# Altium schematic sheet Block_Diagram.SchDoc
size A2; SheetNumber: 1; SheetTotal: 2
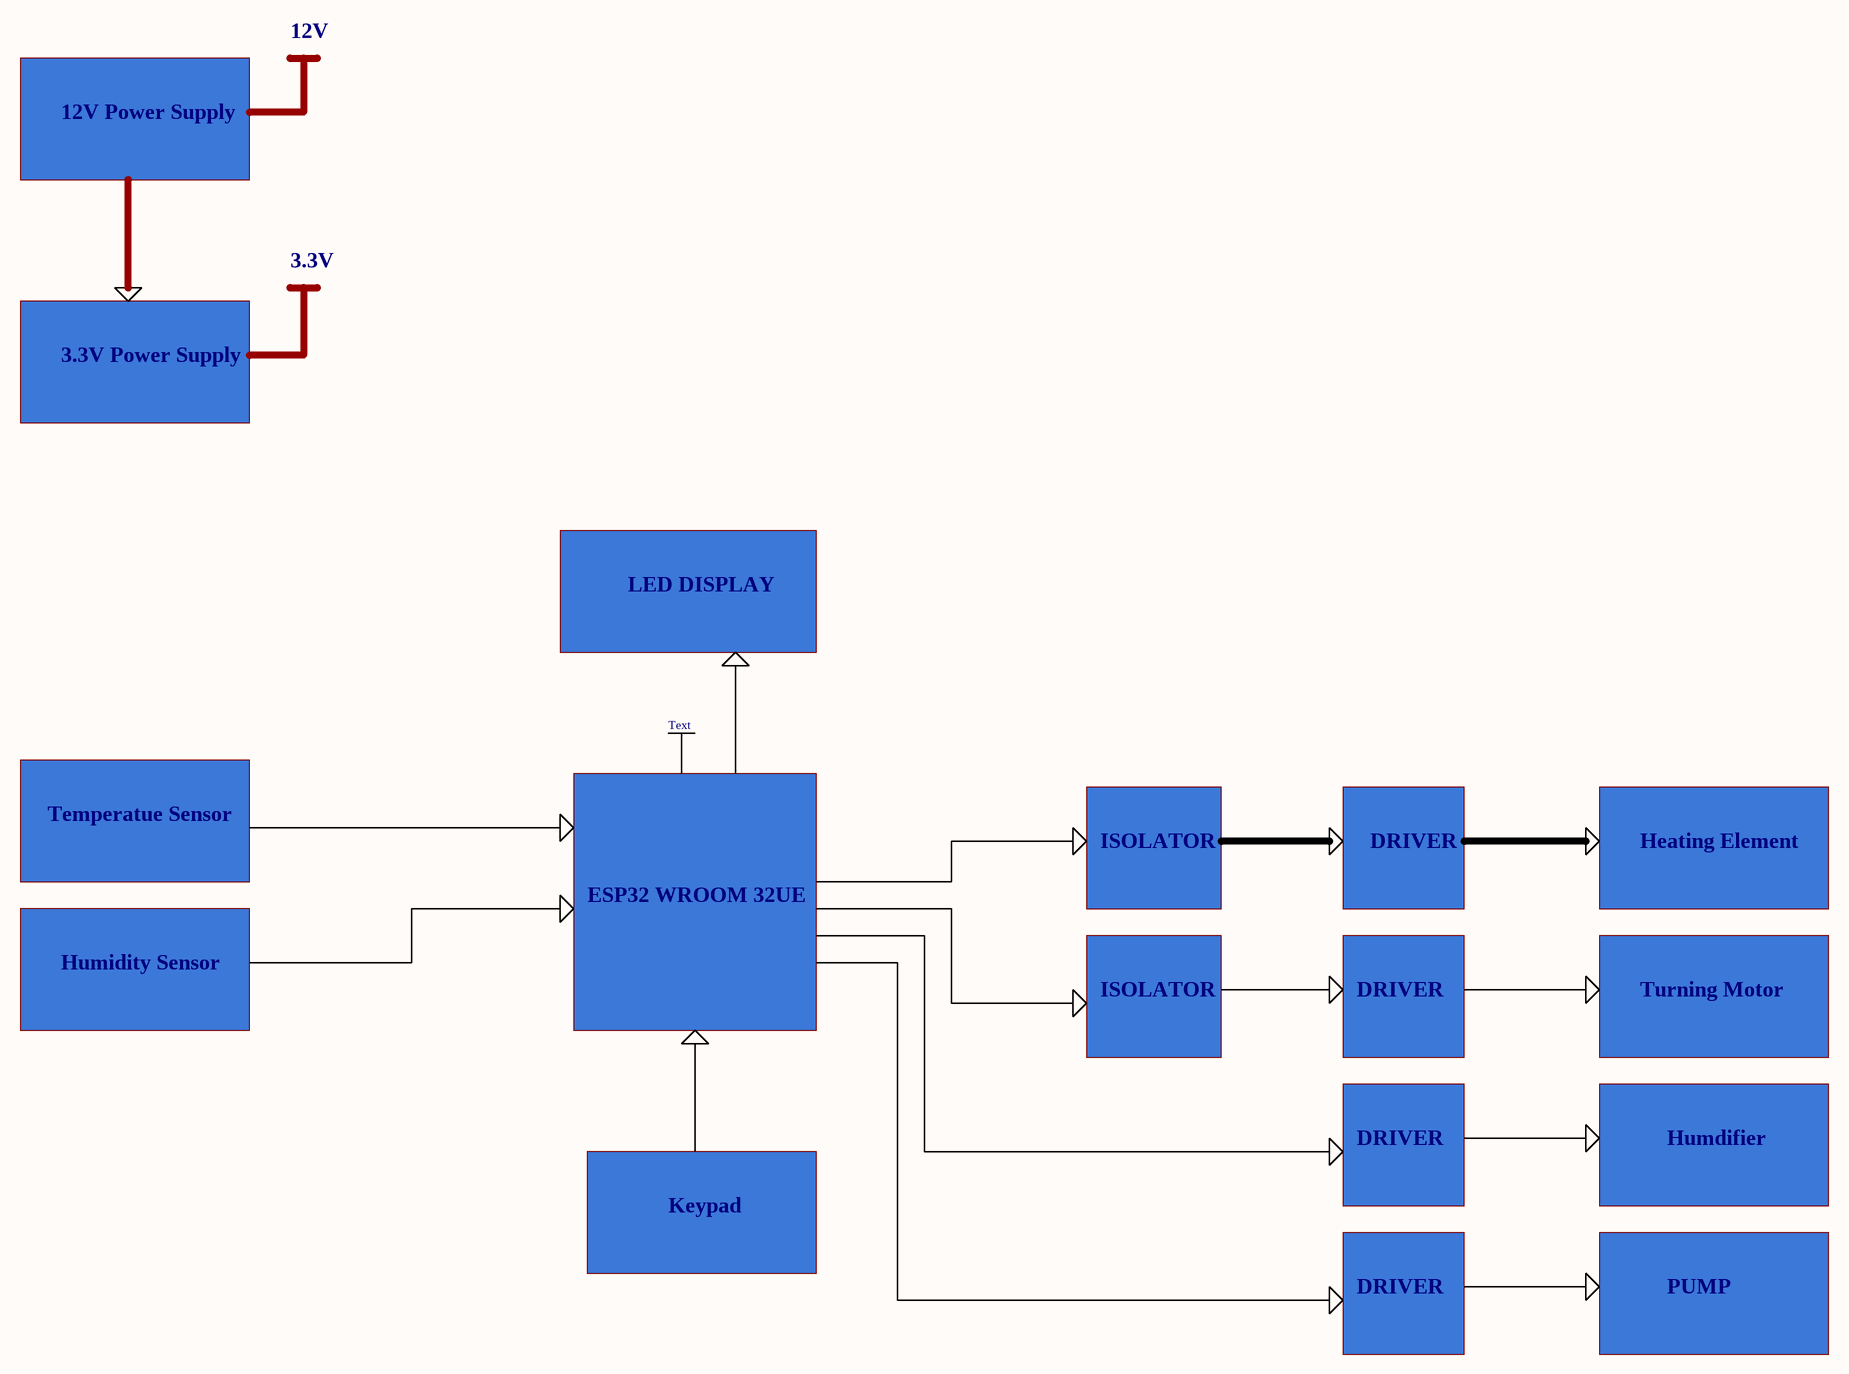
[diagram p0: Block_Diagram.SchDoc]

## Notes on the sheet
- 12V
- 12V Power Supply
- 3.3V
- 3.3V Power Supply
- LED DISPLAY
- Text
- Temperatue Sensor
- ISOLATOR
- DRIVER
- Heating Element
- ESP32 WROOM 32UE
- Humidity Sensor
- Turning Motor
- Humdifier
- Keypad
- PUMP